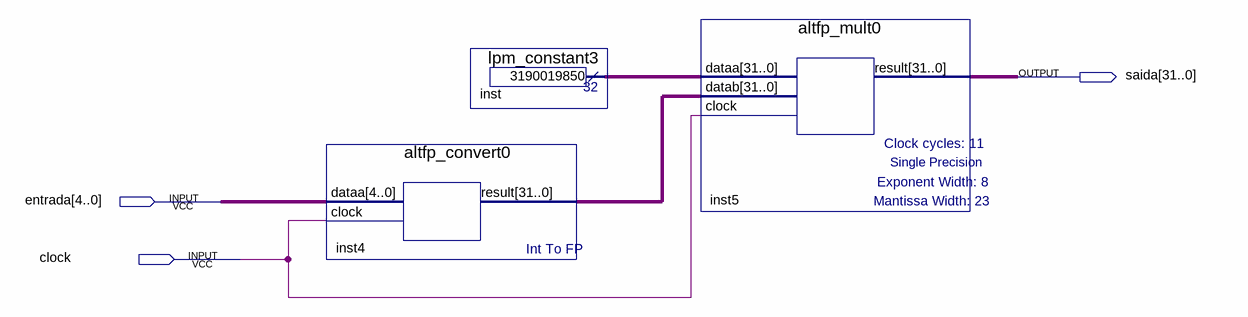
[diagram p0: schematic sheet]
// Quartus schematic blocoF.bdf as structural Verilog: 3 symbols, 3 pins
module blocoF (
  input  [4:0] entrada,
  input  clock,
  output [31:0] saida
);

  wire [31:0] inst4_result, inst_result;

  altfp_convert0 inst4 (.dataa(entrada), .clock(clock), .result(inst4_result));
  lpm_constant3 inst (.result(inst_result));
  altfp_mult0 inst5 (.dataa(inst_result), .datab(inst4_result), .clock(clock), .result(saida));
endmodule
